# EAGLE design breakout (EAGLE 9.5.0)
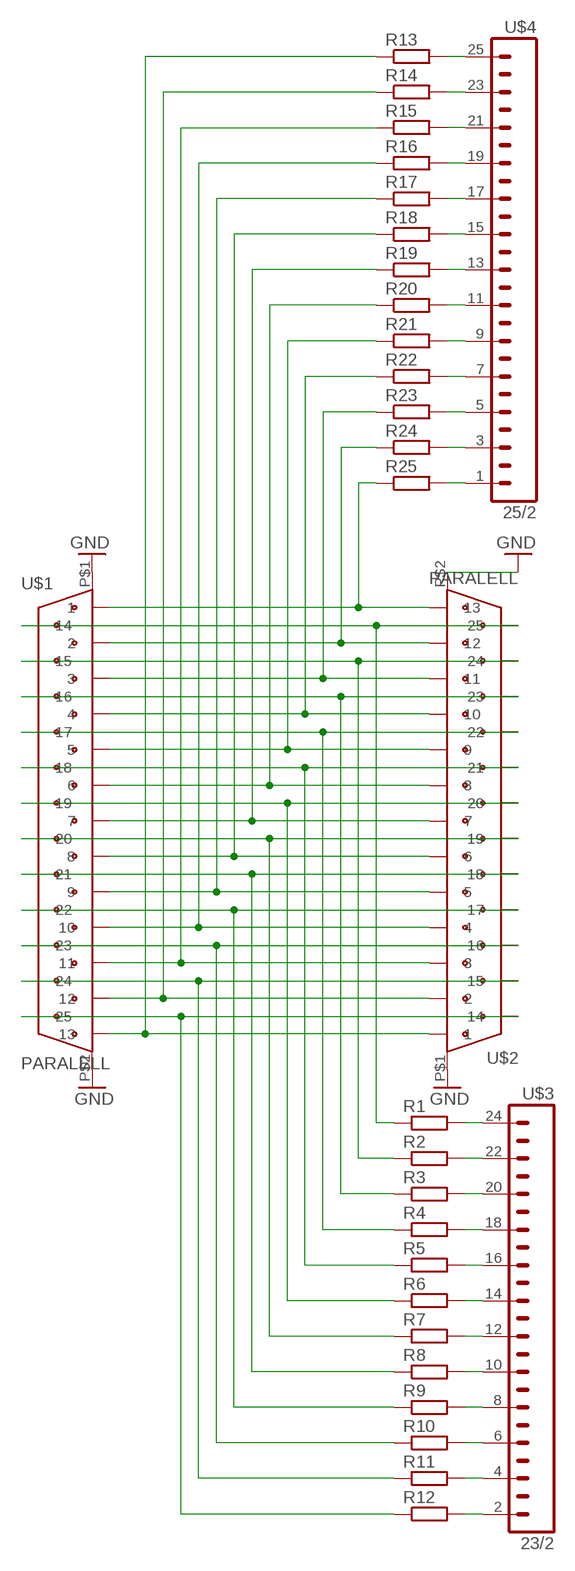
[diagram p0: schematic, sheet 1]

## Parts
R1  R-EU_0204/7  [0204/7]
R2  R-EU_0204/7  [0204/7]
R3  R-EU_0204/7  [0204/7]
R4  R-EU_0204/7  [0204/7]
R5  R-EU_0204/7  [0204/7]
R6  R-EU_0204/7  [0204/7]
R7  R-EU_0204/7  [0204/7]
R8  R-EU_0204/7  [0204/7]
R9  R-EU_0204/7  [0204/7]
R10  R-EU_0204/7  [0204/7]
R11  R-EU_0204/7  [0204/7]
R12  R-EU_0204/7  [0204/7]
R13  R-EU_0204/7  [0204/7]
R14  R-EU_0204/7  [0204/7]
R15  R-EU_0204/7  [0204/7]
R16  R-EU_0204/7  [0204/7]
R17  R-EU_0204/7  [0204/7]
R18  R-EU_0204/7  [0204/7]
R19  R-EU_0204/7  [0204/7]
R20  R-EU_0204/7  [0204/7]
R21  R-EU_0204/7  [0204/7]
R22  R-EU_0204/7  [0204/7]
R23  R-EU_0204/7  [0204/7]
R24  R-EU_0204/7  [0204/7]
R25  R-EU_0204/7  [0204/7]
U$1  PARALELL  [PARALLEL]
U$2  PARALELL  [PARALLEL]
U$3  23/2  [1X23]
U$4  25/2  [1X25]

## Nets
GND: U$1.P$1 U$1.P$2 U$2.P$1 U$2.P$2
N$1: R13.1 U$1.P$15 U$2.P$3
N$2: R14.1 U$1.P$14 U$2.P$4
N$3: R15.1 U$1.P$13 U$2.P$5
N$4: R16.1 U$1.P$12 U$2.P$6
N$5: R17.1 U$1.P$11 U$2.P$7
N$6: R18.1 U$1.P$10 U$2.P$8
N$7: R19.1 U$1.P$9 U$2.P$9
N$8: R20.1 U$1.P$8 U$2.P$10
N$9: R21.1 U$1.P$7 U$2.P$11
N$10: R22.1 U$1.P$6 U$2.P$12
N$11: R23.1 U$1.P$5 U$2.P$13
N$12: R24.1 U$1.P$4 U$2.P$14
N$13: R25.1 U$1.P$3 U$2.P$15
N$14: R1.2 U$3.24
N$15: R2.2 U$3.22
N$16: R3.2 U$3.20
N$17: R4.2 U$3.18
N$18: R5.2 U$3.16
N$19: R6.2 U$3.14
N$20: R7.2 U$3.12
N$21: R8.2 U$3.10
N$22: R9.2 U$3.8
N$23: R10.2 U$3.6
N$24: R11.2 U$3.4
N$25: R12.2 U$3.2
N$26: R13.2 U$4.25
N$27: R14.2 U$4.23
N$28: R15.2 U$4.21
N$29: R16.2 U$4.19
N$30: R17.2 U$4.17
N$31: R18.2 U$4.15
N$32: R19.2 U$4.13
N$33: R20.2 U$4.11
N$34: R21.2 U$4.9
N$35: R22.2 U$4.7
N$36: R23.2 U$4.5
N$37: R24.2 U$4.3
N$38: R25.2 U$4.1
N$39: R1.1 U$1.P$16 U$2.P$27
N$40: R2.1 U$1.P$17 U$2.P$26
N$41: R3.1 U$1.P$18 U$2.P$25
N$42: R4.1 U$1.P$19 U$2.P$24
N$43: R5.1 U$1.P$20 U$2.P$23
N$44: R6.1 U$1.P$21 U$2.P$22
N$45: R7.1 U$1.P$22 U$2.P$21
N$46: R8.1 U$1.P$23 U$2.P$20
N$47: R9.1 U$1.P$24 U$2.P$19
N$48: R10.1 U$1.P$25 U$2.P$18
N$49: R11.1 U$1.P$26 U$2.P$17
N$50: R12.1 U$1.P$27 U$2.P$16

## Library data of the parts
R1-R25 = resistor:R-EU_: RESISTOR, European symbol
U$1 U$2 = FHD-Connectors:PARALELL
U$3 = FHD-Connectors:23/2
U$4 = FHD-Connectors:25/2

## Board
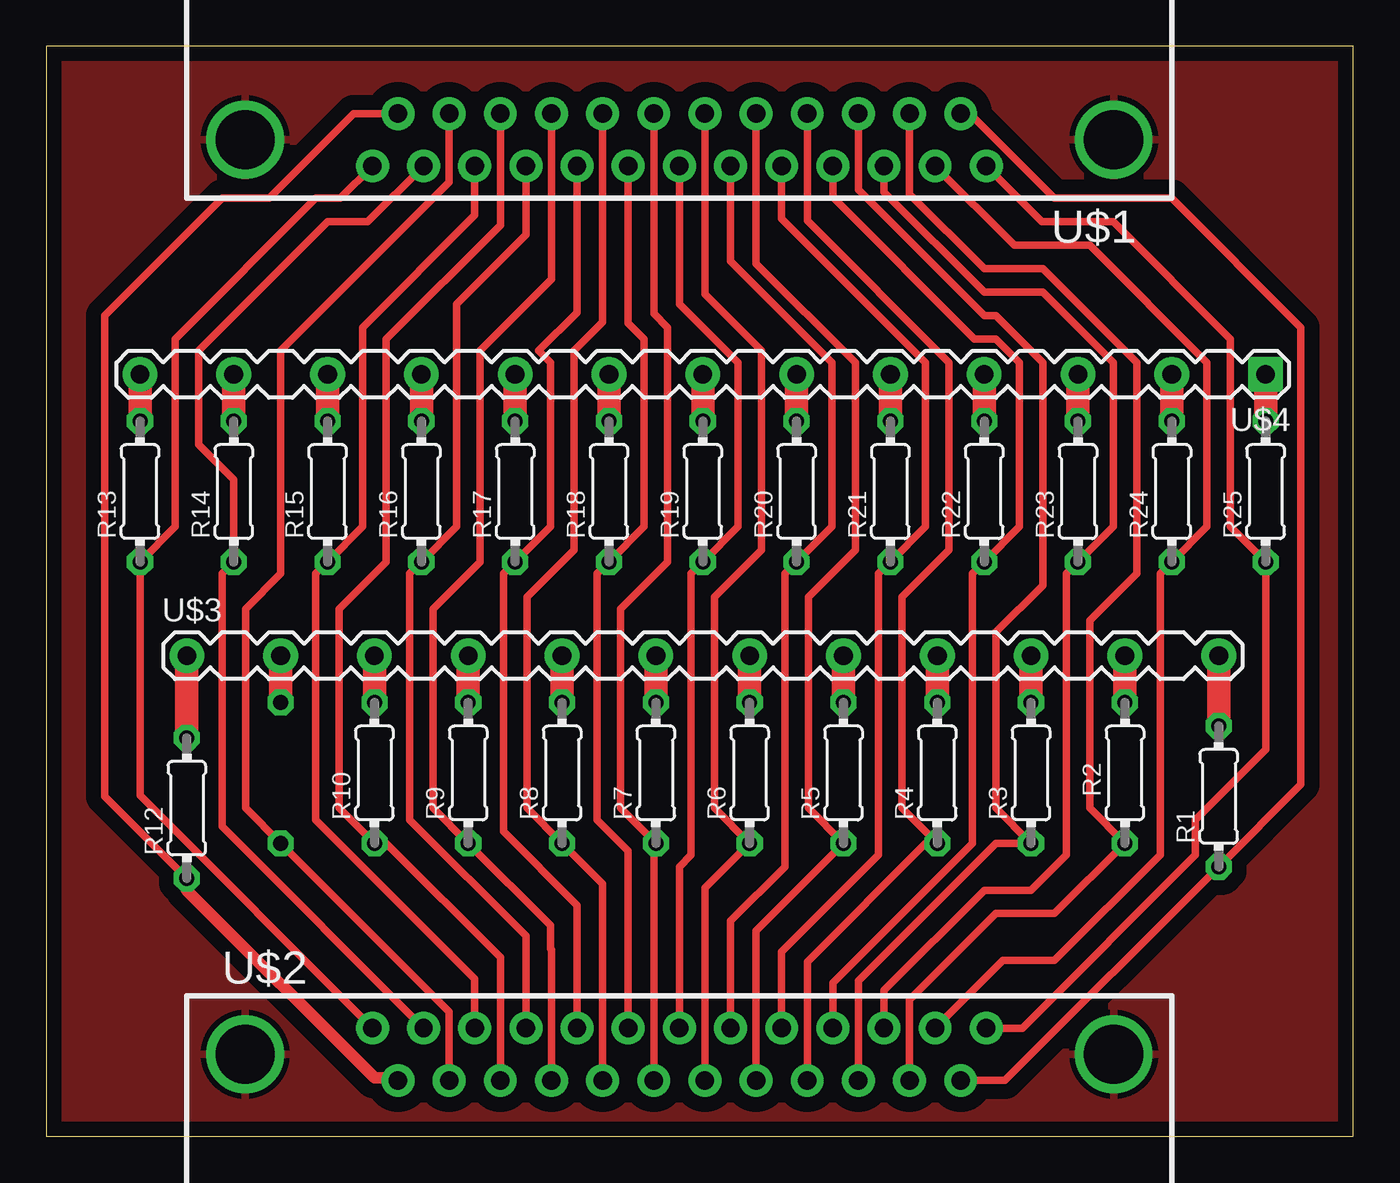
[diagram p1: board, top side]
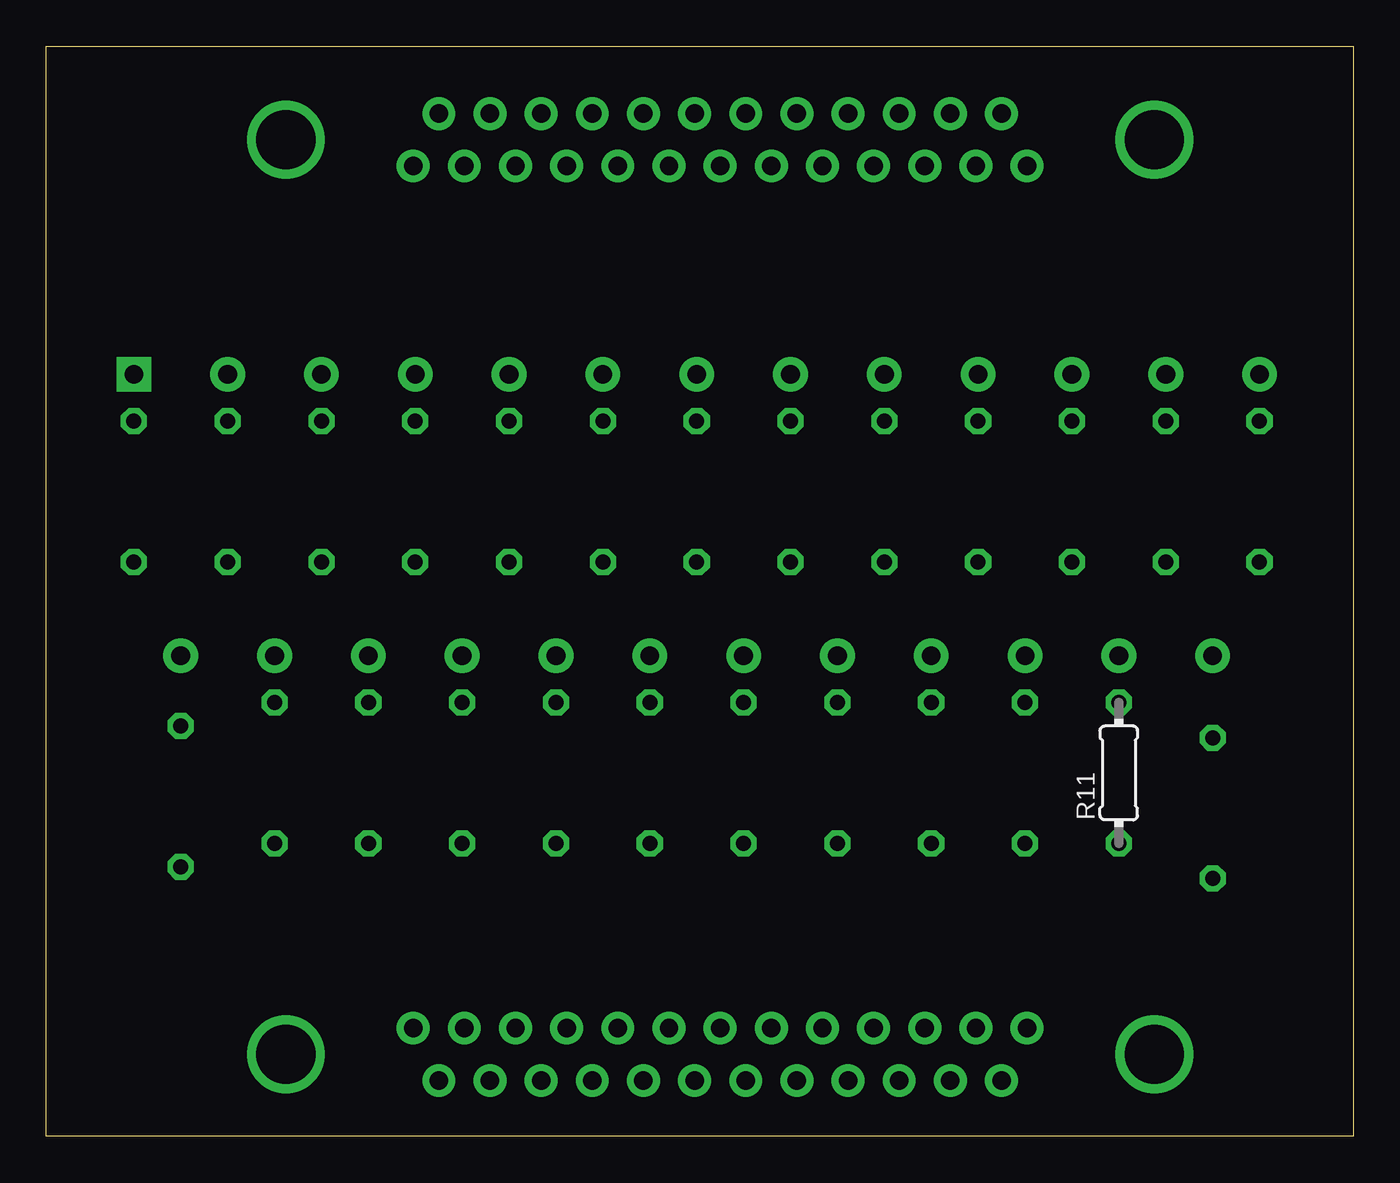
[diagram p2: board, bottom side, seen from below]

Size 70.79 x 59.04 mm. Coordinates in mm from the lower left corner, seen from the top.
Outline: 0,0 70.79,0 70.79,59.04 0,59.04 0,0
Copper layers (1*16): Top 0.035mm / dielectric 1.5mm / Bottom 0.035mm
Design rules "HVA-LPKF": minimum track width 0.3mm, minimum drill 0.6mm, track to track 0.3mm, track to pad 0.3mm, pad to pad 0.3mm, via to via 0.3mm, smd to smd 0.3mm, copper to edge 0.5mm, drill to drill 0.5mm, minimum pad ring 0.3mm, minimum via ring 0.3mm, stop-mask expansion 0.1mm, vias tented up to drill 0mil, thermal gap 0.3mm

### Footprints (pad centres in the part's own frame; a part is rotated, then mirrored left to right if it is on the bottom)
0204/7 = drill 0.813 octagon: 1 -3.81,0; 2 3.81,0
PARALLEL = drill 3.2: P$1 -23.52,0; P$2 23.52,0 | drill 1 pad 1.778: P$3 -16.62,1.42; P$4 -13.85,1.42; P$5 -11.08,1.42; P$6 -8.31,1.42; P$7 -5.54,1.42; P$8 -2.77,1.42; P$9 0,1.42; P$10 2.77,1.42; P$11 5.54,1.42; P$12 8.31,1.42; P$13 11.08,1.42; P$14 13.85,1.42; P$15 16.62,1.42; P$16 -15.235,-1.42; P$17 -12.465,-1.42; P$18 -9.695,-1.42; P$19 -6.925,-1.42; P$20 -4.155,-1.42; P$21 -1.385,-1.42; P$22 1.385,-1.42; P$23 4.155,-1.42; P$24 6.925,-1.42; P$25 9.695,-1.42; P$26 12.465,-1.42; P$27 15.235,-1.42
1X23 = drill 1.016 pad 1.88: 2 -26.67,0; 4 -21.59,0; 6 -16.51,0; 8 -11.43,0; 10 -6.35,0; 12 -1.27,0; 14 3.81,0; 16 8.89,0; 18 13.97,0; 20 19.05,0; 22 24.13,0; 24 29.21,0
1X25 = drill 1.016 pad 1.88 square: 1 0,0 | drill 1.016 pad 1.88: 3 5.08,0; 5 10.16,0; 7 15.24,0; 9 20.32,0; 11 25.4,0; 13 30.48,0; 15 35.56,0; 17 40.64,0; 19 45.72,0; 21 50.8,0; 23 55.88,0; 25 60.96,0

### Placement (x,y rotation side)
R1  63.5,18.42 90 top
R2  58.42,19.69 90 top
R3  53.34,19.69 90 top
R4  48.26,19.69 90 top
R5  43.18,19.69 90 top
R6  38.1,19.69 90 top
R7  33.02,19.69 90 top
R8  27.94,19.69 90 top
R9  22.86,19.69 90 top
R10  17.78,19.69 90 top
R11  12.7,19.69 90 bottom
R12  7.62,17.78 90 top
R13  5.08,34.92 90 top
R14  10.16,34.92 90 top
R15  15.24,34.92 90 top
R16  20.32,34.92 90 top
R17  25.4,34.92 90 top
R18  30.48,34.92 90 top
R19  35.56,34.92 90 top
R20  40.64,34.92 90 top
R21  45.72,34.92 90 top
R22  50.8,34.92 90 top
R23  55.88,34.92 90 top
R24  60.96,34.92 90 top
R25  66.04,34.92 90 top
U$1  34.29,53.98 180 top
U$2  34.29,4.45 0 top
U$3  34.29,26.04 0 top
U$4  66.04,41.27 180 top

### Tracks (layer width: path | path; a pad name or v marks a point on that pad's centre or on a via)
GND
  pour Top (isolate 0.813): 0,0 71.12,0 71.12,59.05 0,59.05
N$1
  Top 0.406: U$2.P$3 5.08,18.46 R13.1 6.99,33.02 6.99,43.18 14.61,50.8 15.91,50.8 U$1.P$15
N$2
  Top 0.406: U$2.P$4 9.53,16.78 9.53,30.48 R14.1 10.16,35.56 8.25,37.46 8.25,42.54 15.24,49.53 17.41,49.53 U$1.P$14
N$3
  Top 0.406: U$2.P$5 23.21,8.54 14.61,17.15 14.61,30.48 R15.1 17.14,33.02 17.14,43.81 23.21,49.88 U$1.P$13
N$4
  Top 0.406: U$2.P$6 25.98,10.85 19.68,17.15 19.68,30.48 R16.1 22.22,33.02 22.22,45.09 25.98,48.84 U$1.P$12
N$5
  Top 0.406: U$2.P$7 28.75,12.53 24.77,16.51 24.77,30.48 R17.1 27.3,33.02 27.3,41.91 26.67,42.54 28.75,44.62 U$1.P$11
N$6
  Top 0.406: U$2.P$8 31.52,15.47 29.84,17.15 29.84,30.48 R18.1 32.38,33.02 32.38,43.18 31.52,44.04 U$1.P$10
N$7
  Top 0.406: U$2.P$9 34.29,14.61 34.92,15.24 34.92,30.48 R19.1 37.46,33.02 37.46,41.91 34.29,45.09 U$1.P$9
N$8
  Top 0.406: U$2.P$10 37.06,11.66 40.01,14.61 40.01,30.48 R20.1 42.55,33.02 42.55,41.91 37.06,47.39 U$1.P$8
N$9
  Top 0.406: U$2.P$11 39.83,9.98 45.09,15.24 45.09,30.48 R21.1 47.62,33.02 47.62,41.91 39.83,49.7 U$1.P$7
N$10
  Top 0.406: U$2.P$12 42.6,8.31 50.16,15.88 50.16,30.48 R22.1 52.7,33.02 52.7,41.91 51.44,43.18 50.27,43.18 42.6,50.85 U$1.P$6
N$11
  Top 0.406: U$2.P$13 45.37,7.9 50.8,13.33 53.34,13.33 55.24,15.24 55.24,30.48 R23.1 57.78,33.02 57.78,41.91 53.98,45.72 50.8,45.72 45.37,51.15 U$1.P$5
N$12
  Top 0.406: U$2.P$14 51.8,9.53 54.61,9.53 60.32,15.24 60.32,30.48 R24.1 62.87,33.02 62.87,41.91 56.52,48.26 52.44,48.26 U$1.P$4
N$13
  Top 0.406: U$2.P$15 52.85,5.87 62.23,15.24 62.23,17.15 66.04,20.96 R25.1 64.14,33.02 64.14,43.18 57.78,49.53 53.94,49.53 U$1.P$3
N$14
  Top 1.27: R1.2 U$3.24
N$15
  Top 1.27: R2.2 U$3.22
N$16
  Top 1.27: R3.2 U$3.20
N$17
  Top 1.27: R4.2 U$3.18
N$18
  Top 1.27: R5.2 U$3.16
N$19
  Top 1.27: R6.2 U$3.14
N$20
  Top 1.27: R7.2 U$3.12
N$21
  Top 1.27: R8.2 U$3.10
N$22
  Top 1.27: R9.2 U$3.8
N$23
  Top 1.27: R10.2 U$3.6
N$24
  Top 1.27: R11.2 U$3.4
N$25
  Top 1.27: R12.2 U$3.2
N$26
  Top 1.27: R13.2 U$4.25
N$27
  Top 1.27: R14.2 U$4.23
N$28
  Top 1.27: R15.2 U$4.21
N$29
  Top 1.27: R16.2 U$4.19
N$30
  Top 1.27: R17.2 U$4.17
N$31
  Top 1.27: R18.2 U$4.15
N$32
  Top 1.27: R19.2 U$4.13
N$33
  Top 1.27: R20.2 U$4.11
N$34
  Top 1.27: R21.2 U$4.9
N$35
  Top 1.27: R22.2 U$4.7
N$36
  Top 1.27: R23.2 U$4.5
N$37
  Top 1.27: R24.2 U$4.3
N$38
  Top 1.27: R25.2 U$4.1
N$39
  Top 0.406: U$2.P$27 51.92,3.03 R1.1 67.95,19.05 67.95,43.81 60.96,50.8 54.61,50.8 50.02,55.39 U$1.P$16
N$40
  Top 0.406: U$2.P$26 46.76,7.38 51.44,12.06 54.61,12.06 R2.1 56.52,17.78 56.52,27.94 59.05,30.48 59.05,41.91 53.98,46.99 50.8,46.99 46.76,51.03 U$1.P$17
N$41
  Top 0.406: U$2.P$25 43.98,8.43 51.44,15.88 R3.1 51.44,17.78 51.44,27.31 53.98,29.85 53.98,41.91 51.44,44.45 50.8,44.45 43.98,51.27 U$1.P$18
N$42
  Top 0.406: U$2.P$24 41.21,9.46 47.62,15.88 R4.1 46.35,17.78 46.35,29.21 48.89,31.75 48.89,41.91 41.21,49.59 U$1.P$19
N$43
  Top 0.406: U$2.P$23 38.45,11.14 R5.1 41.27,17.78 41.27,29.21 43.81,31.75 43.81,41.91 38.45,47.28 U$1.P$20
N$44
  Top 0.406: U$2.P$22 35.67,13.45 R6.1 36.2,17.78 36.2,29.21 38.73,31.75 38.73,42.54 35.67,45.6 U$1.P$21
N$45
  Top 0.406: U$2.P$21 32.91,15.76 R7.1 31.11,17.78 31.11,28.58 33.66,31.12 33.66,43.81 32.91,44.56 U$1.P$22
N$46
  Top 0.406: U$2.P$20 30.13,13.68 R8.1 26.04,17.78 26.04,29.21 28.57,31.75 28.57,42.54 30.13,44.1 U$1.P$23
N$47
  Top 0.406: U$2.P$19 27.36,10.1 27.3,10.16 27.3,11.43 R9.1 20.95,17.78 20.95,28.58 23.49,31.12 23.49,42.54 27.36,46.41 U$1.P$24
N$48
  Top 0.406: U$2.P$18 24.59,9.7 18.41,15.88 R10.1 15.88,17.78 15.88,28.58 18.41,31.12 18.41,43.18 24.59,49.36 U$1.P$25
N$49
  Top 0.406: U$1.P$26 21.82,51.67 12.7,42.54 12.7,30.48 10.8,28.58 10.8,17.78 R11.1 21.82,6.75 U$2.P$17
N$50
  Top 0.406: R12.1 3.17,18.42 3.17,44.45 9.53,50.8 12.07,50.8 16.66,55.39 U$1.P$27
  Top 0.61: U$2.P$16 18.9,3.17 17.78,3.17 7.62,13.33 R12.1